# Altium schematic sheet Power.SchDoc
size A3; Author: Ali Zoubir; Organization: ETML-ES; Address1: Avenue Recordon 1; Address2: 1004 Lausanne; Address3: Switzerland; Revision: 1924B; SheetNumber: 4; SheetTotal: 4; Version: V0
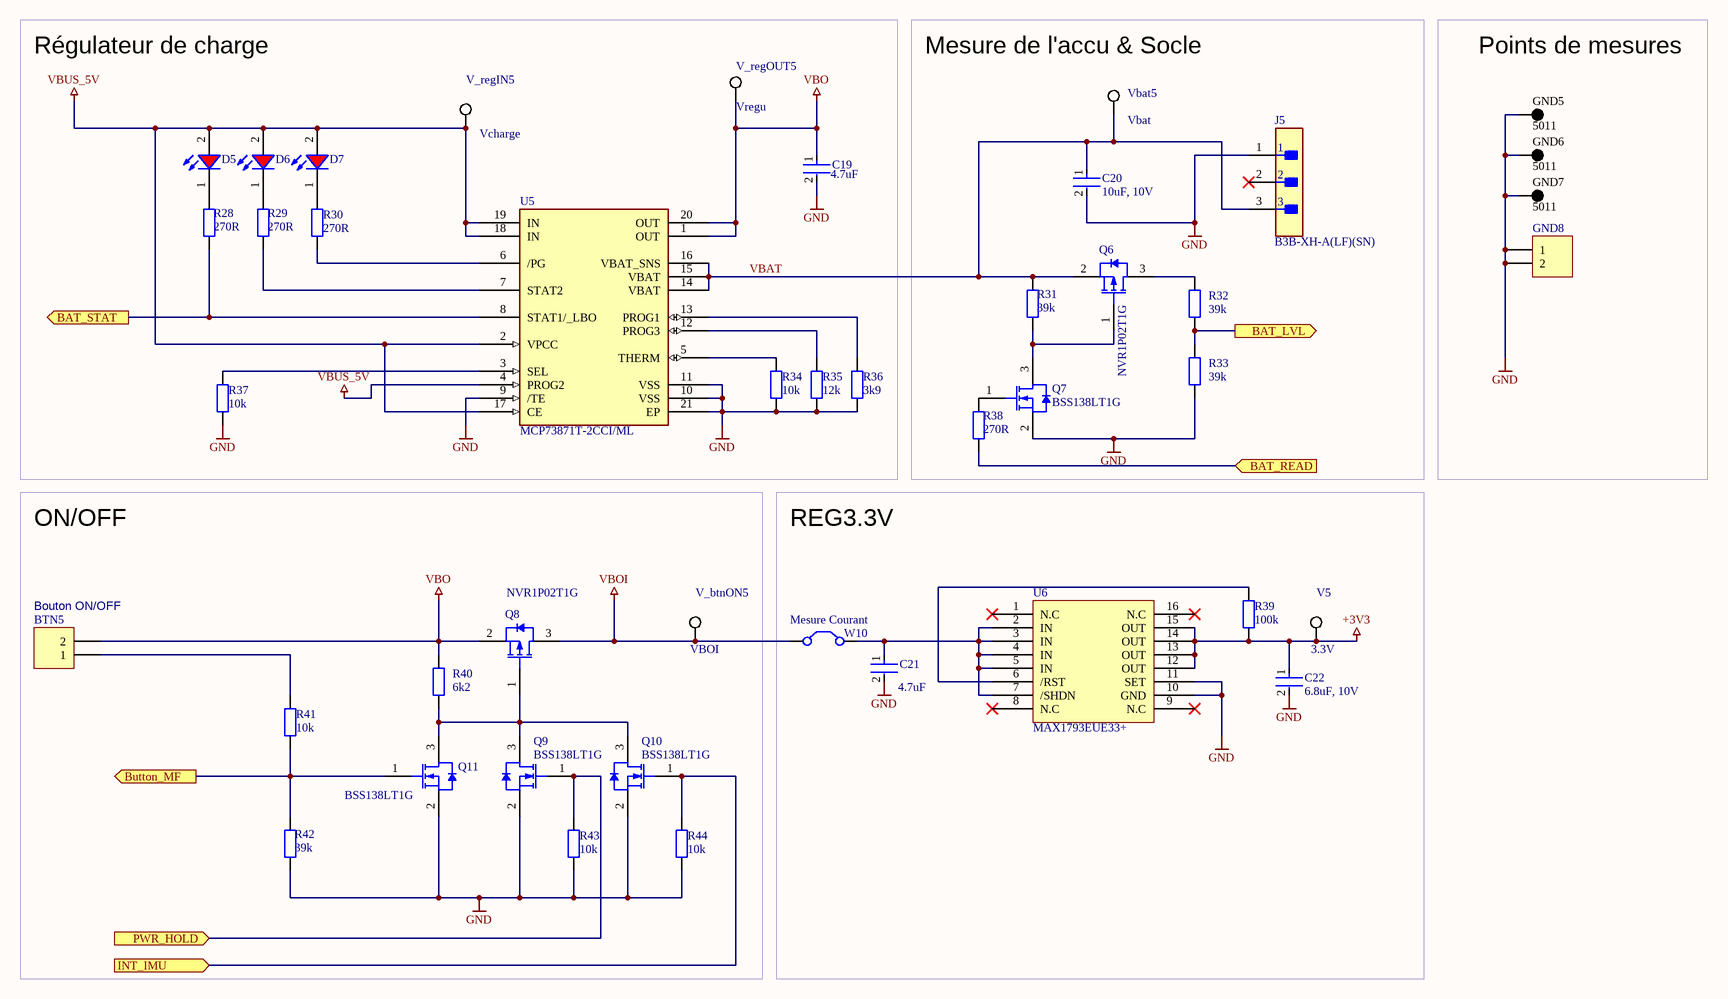
[diagram p0: Power.SchDoc]

## Parts
BTN5  Button connector  [HDR1X2]  (value not drawn)
C19  Capacitance: 4.7uF  [Cap_0805]  (hidden comment: 4.7uF, 35V)
C20  10uF, 10V  [Cap_0805]
C21  Capacitance: 4.7uF  [Cap_0805]  (hidden comment: 4.7uF, 35V)
C22  6.8uF, 10V  [Cap_0805]
D5  Super Red, 1.9 V  [WL-SMCW_0805_150080xx75000]  (value not drawn)
D6  Super Red, 1.9 V  [WL-SMCW_0805_150080xx75000]  (value not drawn)
D7  Super Red, 1.9 V  [WL-SMCW_0805_150080xx75000]  (value not drawn)
GND5  5011  [KSTN-5011_V]
GND6  5011  [KSTN-5011_V]
GND7  5011  [KSTN-5011_V]
GND8  Header 2  [HDR1X2]  (value not drawn)
J5  B3B-XH-A(LF)(SN)  [FP-B3B-XH-A_LF_SN-MFG]
Q6  NVR1P02T1G  [ONSC-SOT-23-3-318-08_V]
Q7  BSS138LT1G  [ONSC-SOT-23-3-318-08_V]
Q8  NVR1P02T1G  [ONSC-SOT-23-3-318-08_V]
Q9  BSS138LT1G  [ONSC-SOT-23-3-318-08_V]
Q10  BSS138LT1G  [ONSC-SOT-23-3-318-08_V]
Q11  BSS138LT1G  [ONSC-SOT-23-3-318-08_V]
R28  270R  [RES_0805]
R29  270R  [RES_0805]
R30  270R  [RES_0805]
R31  39k  [RES_0805]
R32  39k  [RES_0805]
R33  39k  [RES_0805]
R34  10k  [RES_0805]
R35  12k  [RES_0805]
R36  3k9  [RES_0805]
R37  10k  [RES_0805]
R38  270R  [RES_0805]
R39  100k  [RES_0805]
R40  6k2  [RES_0805]
R41  10k  [RES_0805]
R42  39k  [RES_0805]
R43  10k  [RES_0805]
R44  10k  [RES_0805]
U5  MCP73871T-2CCI/ML  [Microchip_C04-126_IPC_B]
U6  MAX1793EUE33+  [TSOP65P640X110_HS-17N]
V5  3.3V  [KSTN-5019_V]
V_btnON5  VBOI  [KSTN-5019_V]
V_regIN5  Vcharge  [KSTN-5019_V]
V_regOUT5  Vregu  [KSTN-5019_V]
Vbat5  Vbat  [KSTN-5019_V]
W10  Jumper  [JUMPER]  (value not drawn)

## Blocks framed on the sheet
Régulateur de charge: C19 D5-D7 R28-R30 R34-R37 U5 V_regIN5 V_regOUT5
Mesure de l'accu & Socle: C20 J5 Q6 Q7 R31-R33 R38 Vbat5
Points de mesures: GND5-GND8
ON/OFF: BTN5 Q8-Q11 R40-R44 V_btnON5
REG3.3V: C21 C22 R39 U6 V5 W10

## Ports
BAT_LVL (out), BAT_READ (in), BAT_STAT (out), Button_MF (out), INT_IMU (in), PWR_HOLD (in)

## Nets
+3V3: C22.1 R39.1 U6.12(OUT) U6.13(OUT) U6.14(OUT) U6.15(OUT) V5.1
GND: C19.2 C20.2 C21.2 C22.2 GND5.1 GND6.1 GND7.1 GND8.1 GND8.2 J5.1 Q7.2(S) Q9.2(S) Q10.2(S) Q11.2(S) R33.1 R34.1 R35.1 R36.1 R37.1 R42.1 R43.1 R44.1 U5.9(/TE) U5.10(VSS) U5.11(VSS) U5.21(EP) U6.10(GND) U6.11(SET)
VBO: BTN5.2 C19.1 Q8.2(S) R40.2 U5.1(OUT) U5.20(OUT) V_regOUT5.1
VBOI: Q8.3(D) V_btnON5.1 W10.1(C1)
VBUS_5V: D5.2(A) D6.2(A) D7.2(A) U5.2(VPCC) U5.4(PROG2) U5.17(CE) U5.18(IN) U5.19(IN) V_regIN5.1
BAT_LVL: R32.1 R33.2 ; port BAT_LVL
BAT_READ: R38.1 ; port BAT_READ
BAT_STAT: R28.1 U5.8(STAT1/_LBO) ; port BAT_STAT
Button_MF: Q11.1(G) R41.1 R42.2 ; port Button_MF
INT_IMU: Q10.1(G) R44.2 ; port INT_IMU
PWR_HOLD: Q9.1(G) R43.2 ; port PWR_HOLD
VBAT: C20.1 J5.3 Q6.2(S) R31.2 U5.14(VBAT) U5.15(VBAT) U5.16(VBAT_SNS) Vbat5.1
NetBTN5_1: BTN5.1 R41.2
NetC21_1: C21.1 U6.2(IN) U6.3(IN) U6.4(IN) U6.5(IN) U6.7(/SHDN) W10.2(C2)
NetD5_1: D5.1(K) R28.2
NetD6_1: D6.1(K) R29.2
NetD7_1: D7.1(K) R30.1
NetQ6_1: Q6.1(G) Q7.3(D) R31.1
NetQ6_3: Q6.3(D) R32.2
NetQ7_1: Q7.1(G) R38.2
NetQ8_1: Q8.1(G) Q9.3(D) Q10.3(D) Q11.3(D) R40.1
NetR29_1: R29.1 U5.7(STAT2)
NetR30_2: R30.2 U5.6(/PG)
NetR34_2: R34.2 U5.5(THERM)
NetR35_2: R35.2 U5.12(PROG3)
NetR36_2: R36.2 U5.13(PROG1)
NetR37_2: R37.2 U5.3(SEL)
NetR39_2: R39.2 U6.6(/RST)

Not connected (* = marked no-connect by the designer): J5 2*; U6 1(N.C)* 8(N.C)* 9(N.C)* 16(N.C)*

## Notes on the sheet
- (near BTN5) Bouton ON/OFF
- (near W10) Mesure Courant
- Fichier :
- a
- Date :
- Heure :
- Version :
- Auteur :
- Modif.
- b
- c
- d
- Projet :
- No :
- Nb feuilles
- Feuille n°
- Chemin :

## Library data of the parts
BTN5 GND8 = Header 2: Header, 2-Pin; LatestRevisionDate: 17-Jul-2002; LatestRevisionNote: Re-released for DXP Platform.; Publisher: Altium Limited
C19 C21 = CMP-08246-002735-1: Multilayer Ceramic Capacitors 4.7μF ±10% 35V X7R SMD 0805; Tolerance: 10%; Depth: 1.25mm; RoHS Compliant: Yes; Construction: Flat; Radiation Hardening: No; Lead Free: Lead Free; Weight: 0.000194oz; Termination: SMD/SMT; Package Quantity: 2000; Dielectric: X7R; Mount: Surface Mount; Voltage Rating: 35V; Case/Package: 0805; Min Operating Temperature: -55°C; Dielectric Material: Ceramic; REACH SVHC: No SVHC; Series: C; Thickness: 0.057inch; Packaging: Tape and Reel; Case Code (Metric): 2012; Max Operating Temperature: 125°C; Case Code (Imperial): 0805; Height: 1.25mm; Width: 0.049inch; Length: 2mm; Voltage Rating (DC): 35V
C20 = CMP-2007-03243-2: CAP CER 10UF 10V X5R 0805; Manufacturer Part Number: C0805C106K8PACTU; Manufacturer: Kemet; 3DS Part Number: 220-00001; Tolerance: 10%; Temperature Coefficient: 15%; Material: Ceramic; Device Class L2: Capacitors; Device Class L1: Passive Components; ComponentLink2URL: https://content.kemet.com/datasheets/KEM_C1006_X5R_SMD.pdf; Height: 1.4mm; Lead Free: Yes; Digikey Description: CAP CER 10UF 10V X5R 0805; Octopart: https://octopart.com/c0805c106k8pactu-kemet-98697; Capacitance: 10uF; Value: 10uF; Temperature Range Low: -55°C; Temperature: -55°C to +85°C; Automotive: No; Mouser Description: CAP CER 10UF 10V X5R 0805; Ipc Land Pattern Name: CAPC200125X125; Temperature Range High: +85°C; Voltage: 10V; RoHS: TRUE; Device Class L3: Ceramic Capacitors; ComponentLink2Description: Datasheet; Voltage Rating: 10V; Package: C0805C-DG; Temperature Characteristic: X5R; Category: Cap
C22 = CMP-08246-000118-1: Cap Ceramic 6.8uF 10V X5R 20% Pad SMD 0805 +85°C Automotive T/R; Capacitance: 6.8uF; Packaging: Tape and Reel; Package Quantity: 2000; Width: 0.049inch; Voltage Rating (DC): 10V; Case Code (Imperial): 0805; Ratings: AEC-Q200; Min Operating Temperature: -55°C; Tolerance: 20%; Length: 0.079inch; Case/Package: 0805; Thickness: 0.057inch; Weight: 0.000194oz; Voltage Rating: 10V; Dielectric: X5R; Case Code (Metric): 2012; Height: 1.25mm; Max Operating Temperature: 85°C; Mount: Surface Mount
D5-D7 = 150080SS75000: SMT Mono-color Chip LED Waterclear WL-SMCW, size 0805, Super Red, 1.9 V, 140 deg, 60 mcd; Forward Voltage: 1.9 V; Viewing Angle: 140 deg; Peak Wavelength: 645 nm; Dominant Wavelength: 630 nm; Luminous Intensity: 60 mcd; Chip Technology: AlInGaP; ComponentLink1Description: Manufacturer; ComponentLink1URL: http://www.we-online.de; ComponentLink2Description: Datasheet; ComponentLink2URL: https://katalog.we-online.de/led/datasheet/150080SS75000.pdf; Part Number: 150080SS75000; Published Date: November 2018; Publisher: Wurth Elektronik; Size: 0805; Operating Temperature: -40 to 85 degC; Emitting Color: Super Red; Mounting Technology: SMT; Packaging: Tape and Reel; Supplier 1: Digi-Key; Supplier Part Number 1: 732-4985-1-ND; Supplier 2: Distrelec; Supplier Part Number 2: 30008875
GND5-GND7 = CMP-1672-00003-4: Test Point, Black, Through Hole, RoHS, Bulk; Manufacturer: Keystone; ComponentLink2URL: http://www.keyelco.com/product-pdf.cfm?p=1320; Colour: Black; Pins: 1; REACH SVHC: No SVHC; ComponentLink1URL: http://www.keyelco.com/; PackageReference: 5011; Contact Plating: Silver; Package Quantity: 100; Packaging: Bulk; RoHSCompliant: true; Height: 8.12 mm; PackageDescription: 1-Pin Through Hole Device, Dia 3.17 mm; Mount: Through Hole; Mounting Technology: Through Hole; DatasheetVersion: Rev. F, 12/2013; ComponentLink1Description: Manufacturer URL; Contact Material: Bronze; ComponentLink2Description: Datasheet
J5 = CMP-17439-000014-3: CONN HEADER VERT 3POS 2.5MM; Max Voltage Rating (DC): 250V; Number of Positions: 3; Current Rating: 3A; Gender: Male; Wire/Cable Gauge: 22AWG; Contact Resistance: 20mR; Insulation Resistance: 1GR; Insulation Material: Nylon; Contact Plating: Tin; Depth: 5.75mm; Contact Type: Male Pin; Max Operating Temperature: 85°C; Insulation Color: Natural; Voltage Rating (AC): 250V; Color: Natural; Connector Type: Header; Orientation: Straight; Fastening Type: Detent; Housing Color: White; Min Operating Temperature: -25°C; Termination: Solder; Voltage Rating: 250V; Series: XH; Pitch: 2.5mm; Contact Shape: Square; Number of Rows: 1; Lead Free: Lead Free; Packaging: Bulk; Mount: Through Hole; Flammability Rating: UL94 V-0; Max Voltage Rating (AC): 250V; REACH SVHC: No SVHC; Housing Material: Polyamide; Contact Material: Brass; Lead Pitch: 2.5mm; Contact Finish - Mating: TIN; Length: 9.9mm; Max Current Rating: 3A; Number of Contacts: 3
Q6 Q8 = CMP-1058-00745-1: Power MOSFET, -20 V, -1 A, P-Channel, 3-Pin SOT-23, Pb-Free, Tape and Reel; Manufacturer: On Semiconductor; Ciss Typ (pF): 165; Configuration: Single; VGS(th) Max (V): 2.3; Channel Polarity: P Channel; V(BR)DSS Min (V): 20; ID Max (A): 1; Coss Typ (pF): 110; Qrr Typ (nC): 8; Crss Typ (pF): 35; PD Max (W): 0.4; DatasheetVersion: Rev. 7; ComponentLink1Description: Manufacturer URL; PackageReference: SOT-23-3-318-08; ComponentLink2Description: Datasheet; ComponentLink2URL: http://www.onsemi.cn/pub_link/Collateral/NTR1P02T1-D.PDF; Packing: Tape and Reel; Package Type: SOT-23-3; ComponentLink1URL: http://www.onsemi.com/; RoHS: Pb-Free; PartNumber: NVR1P02T1G; PackageVersion: Rev. AP, 11/2009; PackageDescription: 3-Pin Small Outline Transistor, Body 2.92 x 1.3 mm, Pitch 0.95 mm; ComponentLink3URL: http://www.onsemi.cn/pub_link/Collateral/318-08.PDF; ComponentLink3Description: Package Specification; VGS Max (V): 20; Mounting Technology: Surface Mount
Q7 Q9-Q11 = CMP-1058-00767-1: Power MOSFET, 200 mA, 50 V, N-Channel, 3-Pin SOT-23, Pb-Free, Tape and Reel; Manufacturer: On Semiconductor; PD Max (W): 0.225; Coss Typ (pF): 12; V(BR)DSS Min (V): 50; VGS Max (V): 20; Channel Polarity: N Channel; Configuration: Single; VGS(th) Max (V): 1.5; Ciss Typ (pF): 40; Crss Typ (pF): 3.5; ID Max (A): 0.2; ComponentLink3Description: Package Specification; PackageDescription: 3-Pin Small Outline Transistor, Body 2.92 x 1.3 mm, Pitch 0.95 mm; PackageReference: SOT-23-3-318-08; RoHS: Pb-Free; Mounting Technology: Surface Mount; ComponentLink1Description: Manufacturer URL; ComponentLink2URL: http://www.onsemi.com/pub_link/Collateral/BSS138LT1-D.PDF; ComponentLink2Description: Datasheet; Packing: Tape and Reel; PackageVersion: Rev. AP, 11/2009; PartNumber: BSS138LT1G; Package Type: SOT-23-3; ComponentLink1URL: http://www.onsemi.com/; DatasheetVersion: Rev. 8; ComponentLink3URL: http://www.onsemi.cn/pub_link/Collateral/318-08.PDF
R28-R30 R38 = CMP-2001-00528-1: Res 0805; Part Number: ERJ6ENF2703V; Manufacturer: Panasonic
R31-R33 R42 = CMP-2001-00410-1: Res 0805; Part Number: ERJ-6GEYJ393V; Manufacturer: Panasonic
R34 R37 R41 R43 R44 = CMP-2001-04376-1: Res 0805; Manufacturer: Panasonic; Part Number: ERJ-6ENF1002V
R35 = CMP-2001-04031-1: Res 0805; Manufacturer: Vishay Dale; Part Number: CRCW08055K60JNEA
R36 = CMP-1013-00510-2: Res 0805; Part Number: CRCW08051K00FKEA; Manufacturer: Vishay Dale
R39 = CMP-2001-00479-1: Res 0805; Manufacturer: Panasonic; Part Number: ERJ-P06J104V
R40 = CMP-2001-00562-1: Res 0805; Part Number: ERJ6ENF6201V; Manufacturer: Panasonic
U5 = MCP73871T-2CCI/ML: Charger IC Lithium Ion/Polymer 20-QFN _4x4_; MF: Microchip; SnapEDA_Link: https://www.snapeda.com/parts/MCP73871T-2CCI/ML/Microchip/view-part/1049920/?ref=snap; Value: *; Digi-Key_Part_Number: MCP73871T-2CCI/MLCT-ND; MP: MCP73871T-2CCI/ML; Digi-Key_Purchase_URL: https://www.digikey.com/product-detail/en/microchip-technology/MCP73871T-2CCI-ML/MCP73871T-2CCI-MLCT-ND/7065594?utm_source=snapeda&utm_medium=aggregator&utm_campaign=symbol; Package: QFN-20 Microchip
V5 V_btnON5 V_regIN5 V_regOUT5 Vbat5 = CMP-1672-00008-1: Test Point, 1 Position SMD, RoHS, Tape and Reel; ComponentLink1Description: Manufacturer URL; Package Quantity: 1000; DatasheetVersion: 03/2014; Packaging: Tape and Reel; ComponentLink2URL: http://www.keyelco.com/product-pdf.cfm?p=1357; ComponentLink1URL: http://www.keyelco.com/; Mount: Surface Mount; Contact Plating: Silver; PackageDescription: 1-Pin Surface Mount Device, Body 3.81 x 2.03 mm; Pins: 1; RoHSCompliant: True; Mounting Technology: Surface Mount; ComponentLink2Description: Datasheet; PackageReference: 5019
W10 = Jumper: Jumper Wire; Published: 24-Mar-1999; LatestRevisionDate: 17-Jul-2002; LatestRevisionNote: Re-released for DXP Platform.; PackageReference: RAD-0.2; Publisher: Altium Limited; PackageDescription: Radial Cap, Thru-Hole; 2 Leads; 0.2 in Pin Spacing